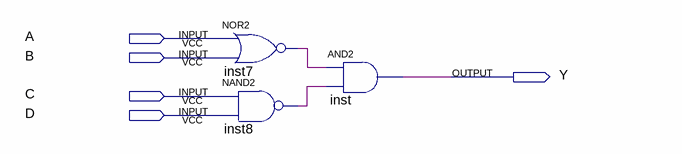
[diagram p0: schematic sheet]
// Quartus schematic lab_1.bdf as structural Verilog: 3 symbols, 5 pins
module lab_1 (
  input  A,
  input  B,
  input  C,
  input  D,
  output Y
);

  wire inst7_out, inst8_out;

  nor inst7 (inst7_out, A, B);
  nand inst8 (inst8_out, C, D);
  and inst (Y, inst7_out, inst8_out);
endmodule
